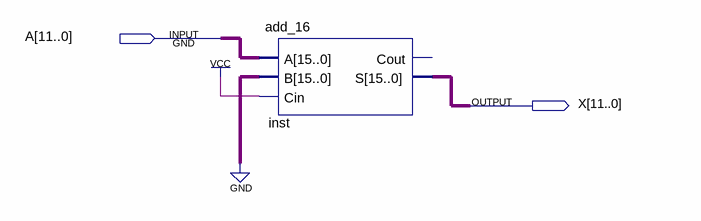
[diagram p0: schematic sheet]
// Quartus schematic inc12.bdf as structural Verilog: 1 symbols, 2 pins
module inc12 (
  input  [11:0] A,
  output [15:0] X
);

  add_16 inst (.A({4'b0000, A}), .B({16{1'b0}}), .Cin(1'b1), .S(X));  // open: Cout
endmodule
